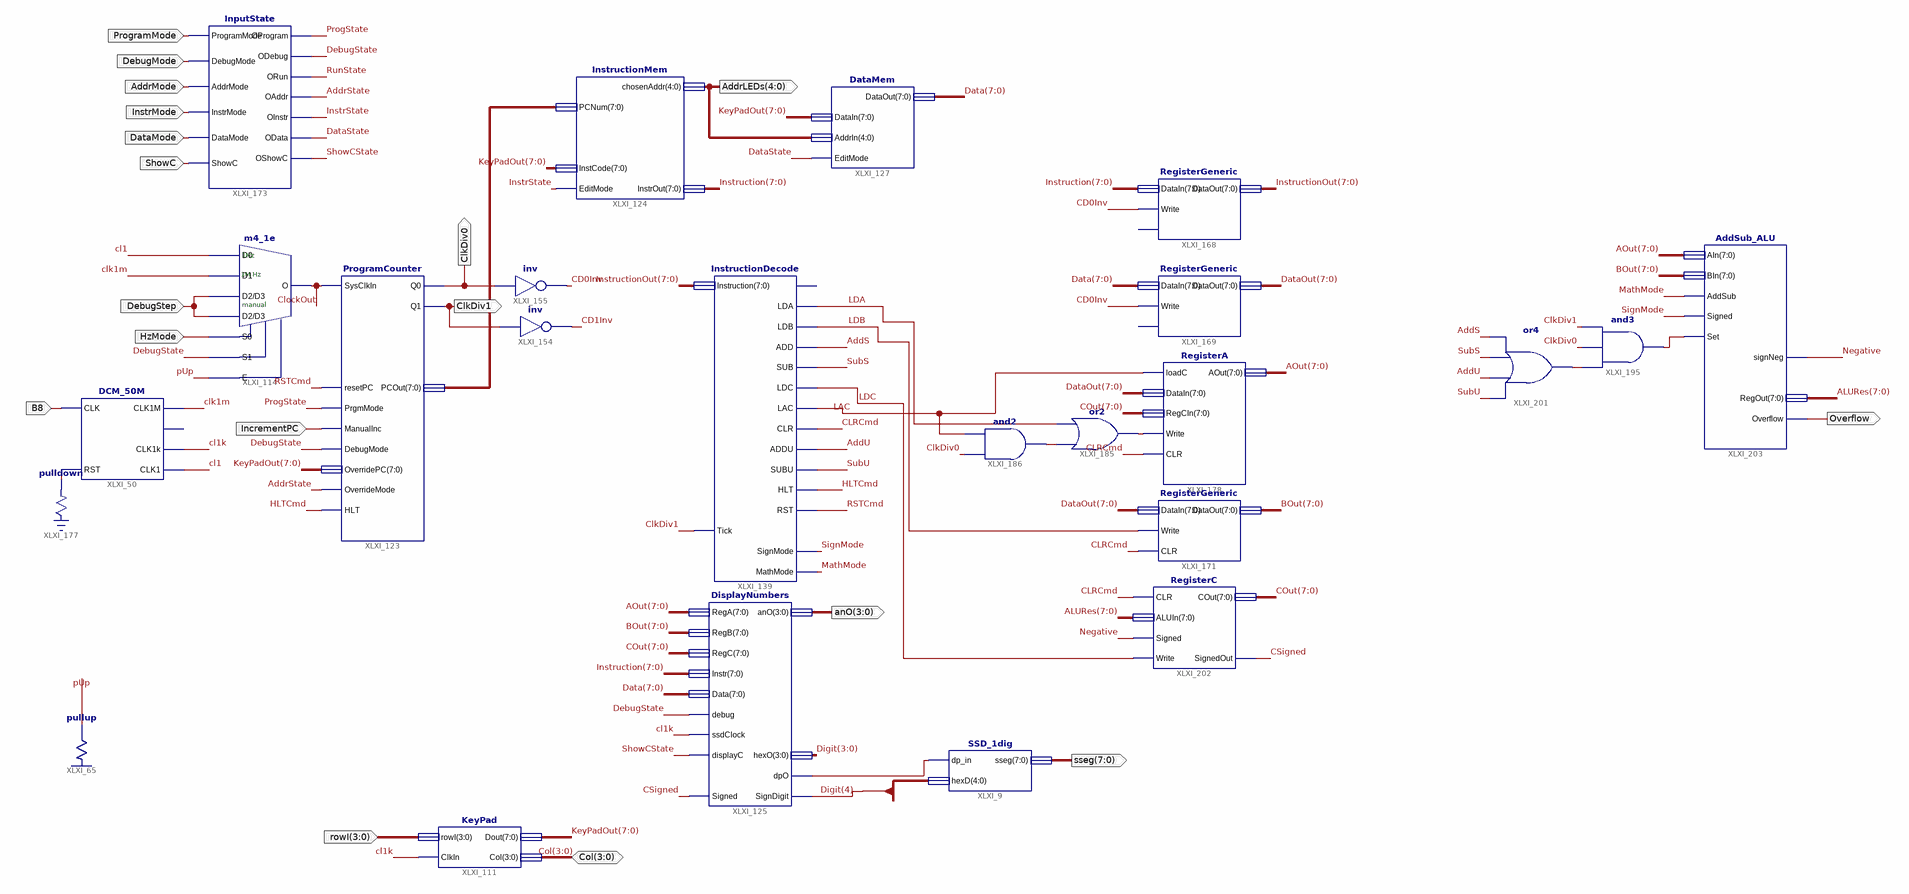
[diagram p0: schematic sheet 1]
// Xilinx ISE schematic toplevel.sch (spartan3e) as structural Verilog: 24 symbols, 18 ports
module toplevel (
  input  B8,
  input  [3:0] rowI,
  input  DebugStep,
  input  HzMode,
  input  ProgramMode,
  input  IncrementPC,
  input  AddrMode,
  input  DataMode,
  input  DebugMode,
  input  InstrMode,
  input  ShowC,
  inout  [3:0] Col,
  output ClkDiv0,
  output ClkDiv1,
  output [4:0] AddrLEDs,
  output [3:0] anO,
  output [7:0] sseg,
  output Overflow
);

  wire AddrState, AddS, AddU, CD0Inv, CD1Inv, cl1, cl1k, clk1m, ClockOut, CLRCmd, CSigned, DataState,
       DebugState, HLTCmd, InstrState, LAC, LDA, LDB, LDC, MathMode, Negative, ProgState, pUp, RSTCmd,
       RunState, ShowCState, SignMode, SubS, SubU, XLXN_129, XLXN_155, XLXN_184, XLXN_185, XLXN_266, XLXN_293;
  wire [4:0] Digit;
  wire [7:0] ALURes, AOut, BOut, COut, Data, DataOut, Instruction, InstructionOut, KeyPadOut, XLXN_59;

  \pullup  XLXI_65 (.O(pUp));
  KeyPad XLXI_111 (.rowI(rowI), .ClkIn(cl1k), .Col(Col), .Dout(KeyPadOut));
  m4_1e XLXI_114 (
    .D0(cl1), .D1(clk1m), .D2(DebugStep), .D3(DebugStep), .E(pUp), .S0(HzMode), .S1(DebugState), .O(ClockOut));
  ProgramCounter XLXI_123 (
    .SysClkIn(ClockOut), .PrgmMode(ProgState), .ManualInc(IncrementPC), .DebugMode(DebugState),
    .OverridePC(KeyPadOut), .OverrideMode(AddrState), .resetPC(RSTCmd), .Q0(ClkDiv0), .Q1(ClkDiv1),
    .PCOut(XLXN_59), .HLT(HLTCmd));
  DisplayNumbers XLXI_125 (
    .RegA(AOut), .RegB(BOut), .RegC(COut), .Instr(Instruction), .Data(Data), .debug(DebugState),
    .ssdClock(cl1k), .displayC(ShowCState), .Signed(CSigned), .anO(anO), .hexO(Digit[3:0]), .dpO(XLXN_129),
    .SignDigit(Digit[4]));
  DataMem XLXI_127 (.AddrIn(AddrLEDs), .DataIn(KeyPadOut), .EditMode(DataState), .DataOut(Data));
  not XLXI_154 (CD1Inv, ClkDiv1);
  not XLXI_155 (CD0Inv, ClkDiv0);
  InputState XLXI_173 (
    .ProgramMode(ProgramMode), .DebugMode(DebugMode), .AddrMode(AddrMode), .InstrMode(InstrMode),
    .DataMode(DataMode), .ShowC(ShowC), .OProgram(ProgState), .ODebug(DebugState), .ORun(RunState),
    .OAddr(AddrState), .OInstr(InstrState), .OData(DataState), .OShowC(ShowCState));
  SSD_1dig XLXI_9 (.dp_in(XLXN_129), .hexD(Digit), .sseg(sseg));
  DCM_50M XLXI_50 (.CLK(B8), .RST(XLXN_155), .CLK1M(clk1m), .CLK1k(cl1k), .CLK1(cl1));  // open: CLK10k
  \pulldown  XLXI_177 (.O(XLXN_155));
  RegisterGeneric XLXI_169 (.DataIn(Data), .Write(CD0Inv), .DataOut(DataOut));  // open: CLR
  RegisterGeneric XLXI_168 (.DataIn(Instruction), .Write(CD0Inv), .DataOut(InstructionOut));  // open: CLR
  RegisterA XLXI_178 (.loadC(LAC), .DataIn(DataOut), .RegCIn(COut), .Write(XLXN_184), .CLR(CLRCmd), .AOut(AOut));
  or XLXI_185 (XLXN_184, XLXN_185, LDA);
  and XLXI_186 (XLXN_185, ClkDiv0, LAC);
  InstructionDecode XLXI_139 (
    .Instruction(InstructionOut), .Tick(ClkDiv1), .LDA(LDA), .LDB(LDB), .ADD(AddS), .SUB(SubS), .LDC(LDC),
    .LAC(LAC), .CLR(CLRCmd), .ADDU(AddU), .SUBU(SubU), .HLT(HLTCmd), .RST(RSTCmd), .SignMode(SignMode),
    .MathMode(MathMode));  // open: NOP
  and XLXI_195 (XLXN_266, XLXN_293, ClkDiv0, ClkDiv1);
  or XLXI_201 (XLXN_293, SubU, AddU, SubS, AddS);
  RegisterC XLXI_202 (.CLR(CLRCmd), .ALUIn(ALURes), .Signed(Negative), .Write(LDC), .COut(COut), .SignedOut(CSigned));
  RegisterGeneric XLXI_171 (.DataIn(DataOut), .Write(LDB), .DataOut(BOut), .CLR(CLRCmd));
  InstructionMem XLXI_124 (
    .InstCode(KeyPadOut), .PCNum(XLXN_59), .EditMode(InstrState), .chosenAddr(AddrLEDs),
    .InstrOut(Instruction));
  AddSub_ALU XLXI_203 (
    .AIn(AOut), .BIn(BOut), .AddSub(MathMode), .Signed(SignMode), .Set(XLXN_266), .signNeg(Negative),
    .Overflow(Overflow), .RegOut(ALURes));

  // Notes on the sheet:
  //   1Hz
  //   1M Hz
  //   manual
endmodule
